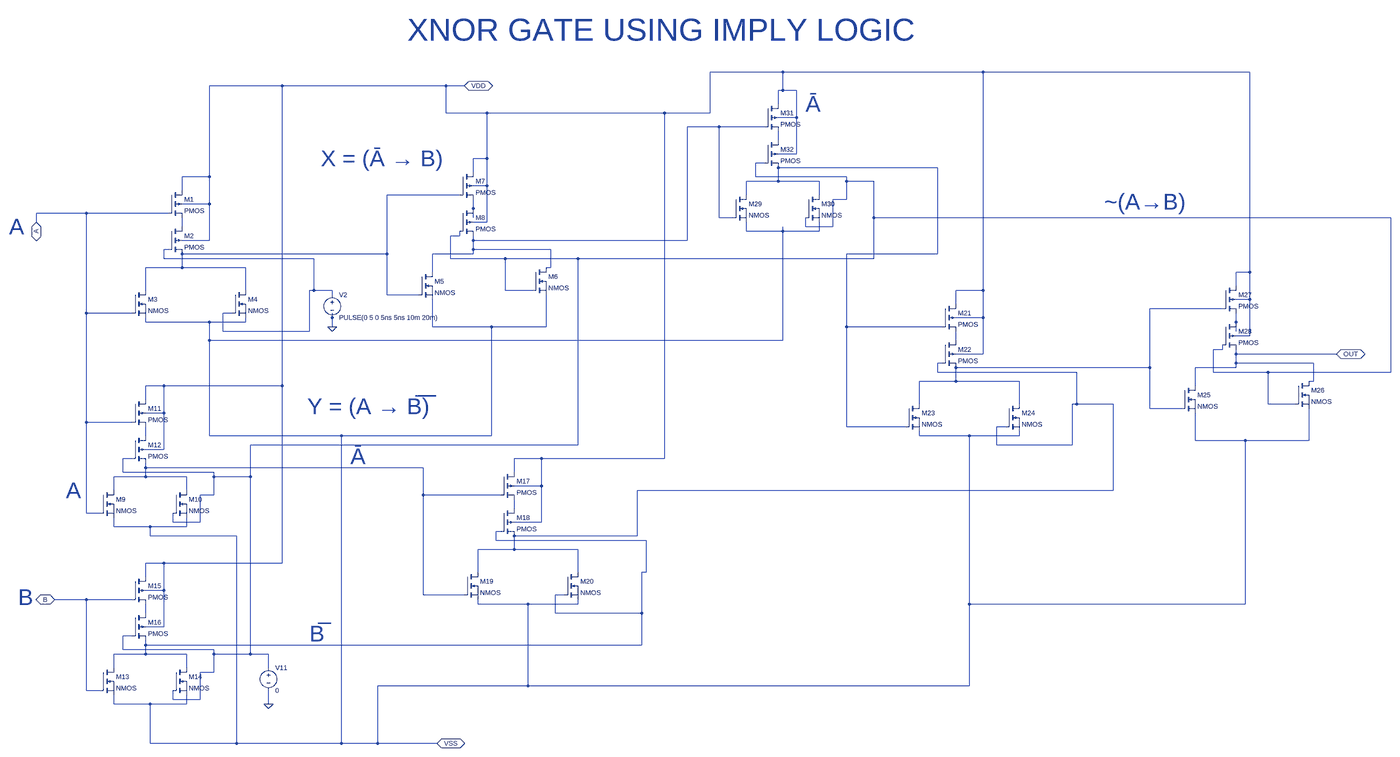
[diagram p0: schematic xnorimply.asc, whole sheet]
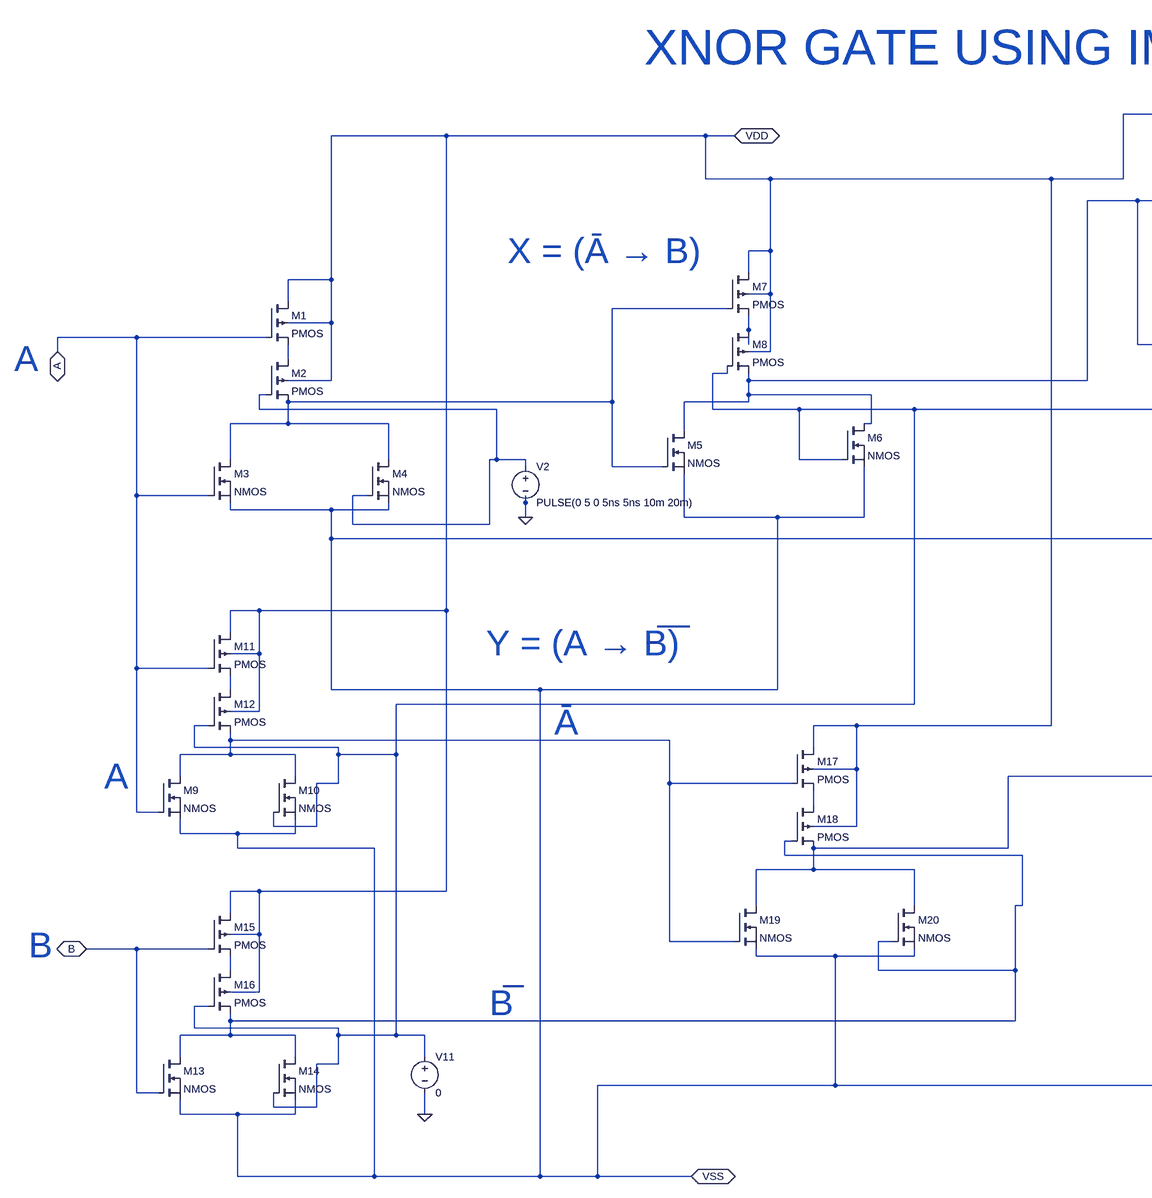
[diagram p1: schematic xnorimply.asc, part, row 1 of 1, column 1 of 2]
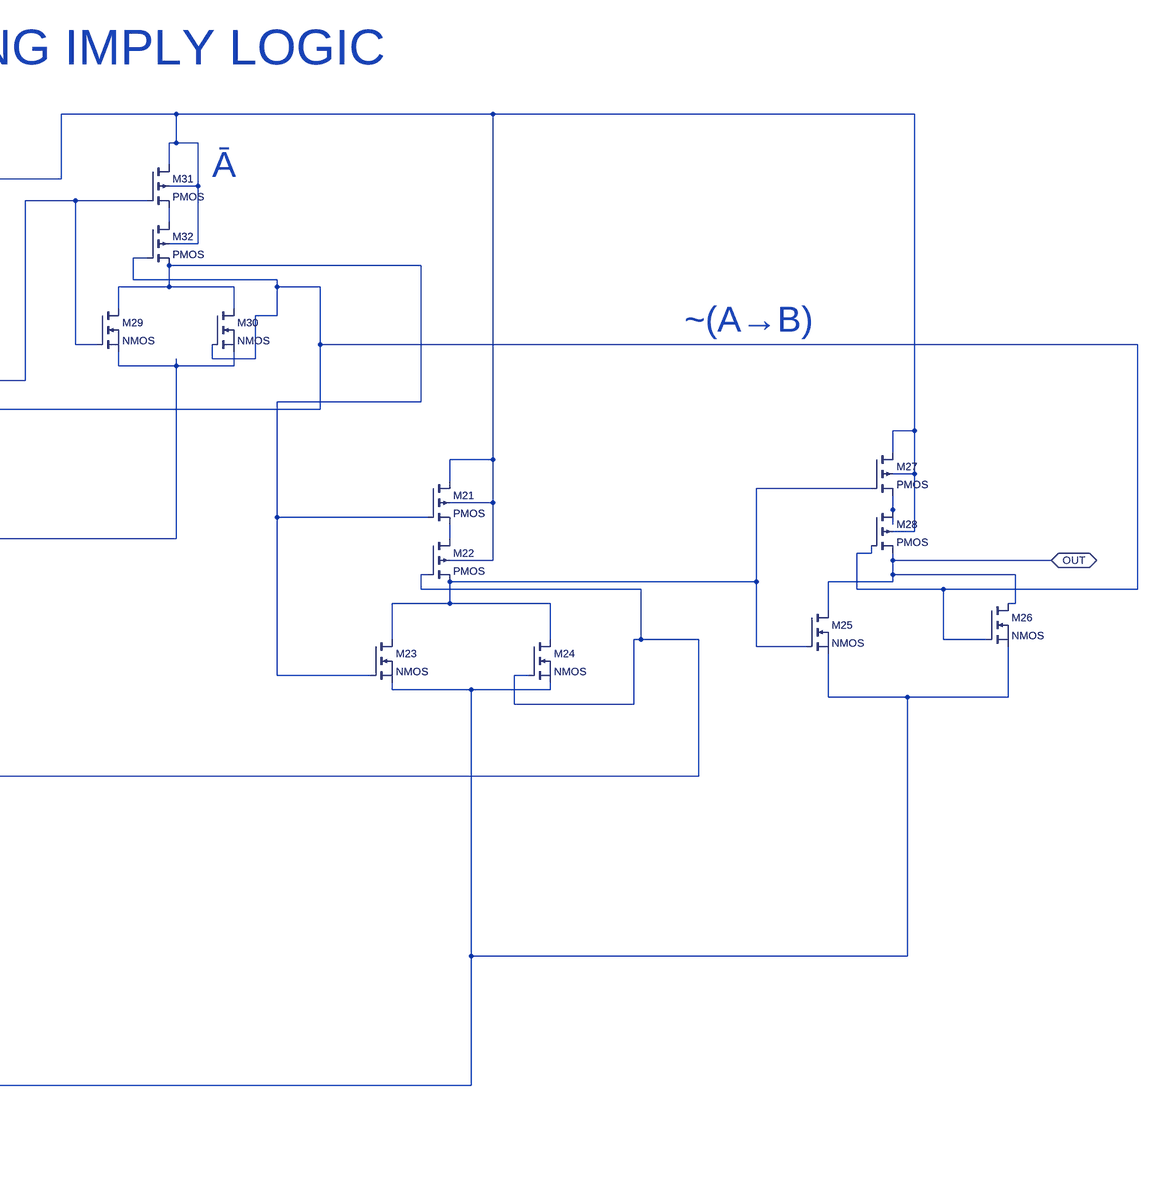
[diagram p2: schematic xnorimply.asc, part, row 1 of 1, column 2 of 2]
xnorimply.asc, the LTspice schematic file:
Version 4
SHEET 1 2996 1624
WIRE 816 -832 560 -832
WIRE 1520 -832 816 -832
WIRE 2496 -832 1520 -832
WIRE -944 -784 -1200 -784
WIRE -368 -784 -944 -784
WIRE -304 -784 -368 -784
WIRE 816 -768 816 -832
WIRE 816 -768 800 -768
WIRE 864 -768 816 -768
WIRE 800 -720 800 -768
WIRE -368 -688 -368 -784
WIRE -224 -688 -368 -688
WIRE 400 -688 -224 -688
WIRE 560 -688 560 -832
WIRE 560 -688 400 -688
WIRE 864 -672 864 -768
WIRE 864 -672 800 -672
WIRE 592 -640 480 -640
WIRE 752 -640 592 -640
WIRE 800 -592 800 -624
WIRE 864 -544 864 -672
WIRE 864 -544 800 -544
WIRE -224 -528 -224 -688
WIRE -224 -528 -272 -528
WIRE 752 -512 720 -512
WIRE 1360 -496 800 -496
WIRE -272 -480 -272 -528
WIRE -1200 -464 -1200 -784
WIRE -1200 -464 -1296 -464
WIRE 720 -464 720 -512
WIRE 1040 -464 720 -464
WIRE 800 -448 800 -496
WIRE 800 -448 688 -448
WIRE 944 -448 800 -448
WIRE 1040 -448 1040 -464
WIRE 1136 -448 1040 -448
WIRE -224 -432 -224 -528
WIRE -224 -432 -272 -432
WIRE -1296 -416 -1296 -464
WIRE -320 -400 -576 -400
WIRE 688 -400 688 -448
WIRE 944 -400 944 -448
WIRE 1040 -384 1040 -448
WIRE 1040 -384 992 -384
WIRE -1200 -368 -1200 -464
WIRE -1200 -368 -1296 -368
WIRE -272 -352 -272 -384
WIRE -1632 -336 -1808 -336
WIRE -1344 -336 -1632 -336
WIRE -272 -320 -272 -352
WIRE 592 -320 592 -640
WIRE 640 -320 592 -320
WIRE 1136 -320 1136 -448
WIRE 2992 -320 1136 -320
WIRE -1808 -304 -1808 -336
WIRE -224 -304 -224 -432
WIRE -224 -304 -272 -304
WIRE -1296 -288 -1296 -320
WIRE 896 -288 896 -320
WIRE 992 -288 992 -384
WIRE 992 -288 896 -288
WIRE 688 -272 688 -304
WIRE 816 -272 816 -288
WIRE 816 -272 688 -272
WIRE 944 -272 944 -304
WIRE 944 -272 816 -272
WIRE -320 -256 -320 -272
WIRE -320 -256 -352 -256
WIRE -1200 -240 -1200 -368
WIRE -1200 -240 -1296 -240
WIRE -272 -240 -272 -256
WIRE 480 -240 480 -640
WIRE 480 -240 -272 -240
WIRE -1344 -208 -1360 -208
WIRE -272 -208 -272 -240
WIRE 0 -208 -272 -208
WIRE -576 -192 -576 -400
WIRE -576 -192 -1296 -192
WIRE -272 -192 -272 -208
WIRE -272 -192 -416 -192
WIRE 1360 -192 1360 -496
WIRE 1360 -192 1040 -192
WIRE -1360 -176 -1360 -208
WIRE -832 -176 -1360 -176
WIRE -352 -176 -352 -256
WIRE -160 -176 -352 -176
WIRE 96 -176 -160 -176
WIRE 1136 -176 1136 -320
WIRE 1136 -176 96 -176
WIRE -1296 -144 -1296 -192
WIRE -1296 -144 -1424 -144
WIRE -1072 -144 -1296 -144
WIRE 0 -144 0 -208
WIRE 0 -144 -16 -144
WIRE -416 -128 -416 -192
WIRE 2496 -128 2496 -832
WIRE 2496 -128 2448 -128
WIRE 2448 -80 2448 -128
WIRE -1424 -64 -1424 -144
WIRE -1072 -64 -1072 -144
WIRE -832 -64 -832 -176
WIRE -832 -64 -848 -64
WIRE -768 -64 -832 -64
WIRE -160 -64 -160 -176
WIRE -64 -64 -160 -64
WIRE 1520 -64 1520 -832
WIRE 1520 -64 1424 -64
WIRE -768 -48 -768 -64
WIRE -576 -48 -576 -192
WIRE -464 -48 -576 -48
WIRE 2496 -32 2496 -128
WIRE 2496 -32 2448 -32
WIRE 1424 -16 1424 -64
WIRE 2400 0 2144 0
WIRE -1632 16 -1632 -336
WIRE -1472 16 -1632 16
WIRE -1120 16 -1152 16
WIRE -768 32 -768 16
WIRE 1520 32 1520 -64
WIRE 1520 32 1424 32
WIRE -1424 48 -1424 32
WIRE -1200 48 -1424 48
WIRE -1072 48 -1072 32
WIRE -1072 48 -1200 48
WIRE 2448 48 2448 16
WIRE -768 64 -768 32
WIRE -416 64 -416 -32
WIRE -208 64 -416 64
WIRE -16 64 -16 -48
WIRE -16 64 -208 64
WIRE 1040 64 1040 -192
WIRE 1376 64 1040 64
WIRE -1152 80 -1152 16
WIRE -848 80 -848 -64
WIRE -848 80 -1152 80
WIRE 2448 80 2448 48
WIRE 2496 96 2496 -32
WIRE 2496 96 2448 96
WIRE -1200 112 -1200 48
WIRE 816 112 816 -272
WIRE 816 112 -1200 112
WIRE 1424 112 1424 80
WIRE 2400 144 2400 128
WIRE 2400 144 2368 144
WIRE 1520 160 1520 32
WIRE 1520 160 1424 160
WIRE 2448 160 2448 144
WIRE 2800 160 2448 160
WIRE 1376 192 1360 192
WIRE 2448 192 2448 160
WIRE 2720 192 2448 192
WIRE 2144 208 2144 0
WIRE 2144 208 1424 208
WIRE 2448 208 2448 192
WIRE 2448 208 2304 208
WIRE 1360 224 1360 192
WIRE 1888 224 1360 224
WIRE 2368 224 2368 144
WIRE 2560 224 2368 224
WIRE 2992 224 2992 -320
WIRE 2992 224 2560 224
WIRE 1424 256 1424 208
WIRE 1424 256 1296 256
WIRE 1648 256 1424 256
WIRE 2720 256 2720 192
WIRE 2720 256 2704 256
WIRE -1360 272 -1424 272
WIRE -944 272 -944 -784
WIRE -944 272 -1360 272
WIRE 2304 272 2304 208
WIRE -1424 320 -1424 272
WIRE 1296 336 1296 256
WIRE 1648 336 1648 256
WIRE 1888 336 1888 224
WIRE 1888 336 1872 336
WIRE 2016 336 1888 336
WIRE 2560 336 2560 224
WIRE 2656 336 2560 336
WIRE 2144 352 2144 208
WIRE 2256 352 2144 352
WIRE -1360 368 -1360 272
WIRE -1360 368 -1424 368
WIRE -1632 400 -1632 16
WIRE -1472 400 -1632 400
WIRE 1040 416 1040 64
WIRE 1248 416 1040 416
WIRE 1600 416 1568 416
WIRE -1424 448 -1424 416
WIRE -1200 448 -1200 112
WIRE -736 448 -1200 448
WIRE -208 448 -208 64
WIRE -208 448 -736 448
WIRE 1296 448 1296 432
WIRE 1472 448 1296 448
WIRE 1648 448 1648 432
WIRE 1648 448 1472 448
WIRE 2304 464 2304 368
WIRE 2480 464 2304 464
WIRE 2704 464 2704 352
WIRE 2704 464 2480 464
WIRE 96 480 96 -176
WIRE 96 480 -1056 480
WIRE 1568 480 1568 416
WIRE 1872 480 1872 336
WIRE 1872 480 1568 480
WIRE -1360 496 -1360 368
WIRE -1360 496 -1424 496
WIRE -1472 528 -1504 528
WIRE -32 528 -128 528
WIRE 400 528 400 -688
WIRE 400 528 -32 528
WIRE -1424 560 -1424 544
WIRE -448 560 -1424 560
WIRE -1504 576 -1504 528
WIRE -1184 576 -1504 576
WIRE -128 576 -128 528
WIRE -1424 592 -1424 560
WIRE -1424 592 -1536 592
WIRE -1280 592 -1424 592
WIRE -1184 592 -1184 576
WIRE -1056 592 -1056 480
WIRE -1056 592 -1184 592
WIRE -32 624 -32 528
WIRE -32 624 -128 624
WIRE -1536 640 -1536 592
WIRE -1280 640 -1280 592
WIRE 2016 640 2016 336
WIRE 2016 640 304 640
WIRE -1184 656 -1184 592
WIRE -1184 656 -1232 656
WIRE -448 656 -448 560
WIRE -176 656 -448 656
WIRE -128 704 -128 672
WIRE -1632 720 -1632 400
WIRE -1584 720 -1632 720
WIRE -1328 752 -1328 720
WIRE -1232 752 -1232 656
WIRE -1232 752 -1328 752
WIRE -32 752 -32 624
WIRE -32 752 -128 752
WIRE -1536 768 -1536 736
WIRE -1408 768 -1536 768
WIRE -1280 768 -1280 736
WIRE -1280 768 -1408 768
WIRE -176 784 -192 784
WIRE -1408 800 -1408 768
WIRE -1104 800 -1408 800
WIRE 304 800 304 640
WIRE 304 800 -128 800
WIRE -192 816 -192 784
WIRE 336 816 -192 816
WIRE -128 848 -128 800
WIRE -128 848 -256 848
WIRE 96 848 -128 848
WIRE -1360 896 -1424 896
WIRE -944 896 -944 272
WIRE -944 896 -1360 896
WIRE -256 928 -256 848
WIRE 96 928 96 848
WIRE 336 928 336 816
WIRE 336 928 320 928
WIRE -1424 944 -1424 896
WIRE -1360 992 -1360 896
WIRE -1360 992 -1424 992
WIRE -448 1008 -448 656
WIRE -304 1008 -448 1008
WIRE 48 1008 16 1008
WIRE -1632 1024 -1744 1024
WIRE -1472 1024 -1632 1024
WIRE -256 1040 -256 1024
WIRE -80 1040 -256 1040
WIRE 96 1040 96 1024
WIRE 96 1040 -80 1040
WIRE 1472 1040 1472 448
WIRE 2480 1040 2480 464
WIRE 2480 1040 1472 1040
WIRE -1424 1072 -1424 1040
WIRE 16 1072 16 1008
WIRE 320 1072 320 928
WIRE 320 1072 16 1072
WIRE -1360 1120 -1360 992
WIRE -1360 1120 -1424 1120
WIRE -1472 1152 -1504 1152
WIRE -1424 1184 -1424 1168
WIRE 320 1184 320 1072
WIRE 320 1184 -1424 1184
WIRE -1504 1200 -1504 1152
WIRE -1184 1200 -1504 1200
WIRE -1424 1216 -1424 1184
WIRE -1424 1216 -1536 1216
WIRE -1280 1216 -1424 1216
WIRE -1184 1216 -1184 1200
WIRE -1056 1216 -1056 592
WIRE -1056 1216 -1184 1216
WIRE -992 1216 -1056 1216
WIRE -1536 1264 -1536 1216
WIRE -1280 1264 -1280 1216
WIRE -992 1264 -992 1216
WIRE -1184 1280 -1184 1216
WIRE -1184 1280 -1232 1280
WIRE -80 1328 -80 1040
WIRE -80 1328 -608 1328
WIRE 1472 1328 1472 1040
WIRE 1472 1328 -80 1328
WIRE -1632 1344 -1632 1024
WIRE -1584 1344 -1632 1344
WIRE -1328 1376 -1328 1344
WIRE -1232 1376 -1232 1280
WIRE -1232 1376 -1328 1376
WIRE -1536 1392 -1536 1360
WIRE -1408 1392 -1536 1392
WIRE -1280 1392 -1280 1360
WIRE -1280 1392 -1408 1392
WIRE -992 1392 -992 1344
WIRE -1408 1552 -1408 1392
WIRE -1104 1552 -1104 800
WIRE -1104 1552 -1408 1552
WIRE -736 1552 -736 448
WIRE -736 1552 -1104 1552
WIRE -608 1552 -608 1328
WIRE -608 1552 -736 1552
WIRE -400 1552 -608 1552
FLAG -768 64 0
FLAG -992 1392 0
FLAG 2800 160 OUT
IOPIN 2800 160 BiDir
FLAG -1808 -304 A
IOPIN -1808 -304 BiDir
FLAG -1744 1024 B
IOPIN -1744 1024 BiDir
FLAG -400 1552 VSS
IOPIN -400 1552 BiDir
FLAG -304 -784 VDD
IOPIN -304 -784 BiDir
SYMBOL pmos4 -1344 -416 R0
SYMATTR InstName M1
SYMBOL pmos4 -1344 -288 R0
SYMATTR InstName M2
SYMBOL nmos -1472 -64 R0
SYMATTR InstName M3
SYMBOL nmos -1120 -64 R0
SYMATTR InstName M4
SYMBOL voltage -768 -64 R0
WINDOW 123 0 0 Left 0
WINDOW 39 0 0 Left 0
SYMATTR InstName V2
SYMATTR Value PULSE(0 5 0 5ns 5ns 10m 20m)
SYMBOL nmos -464 -128 R0
SYMATTR InstName M5
SYMBOL nmos -64 -144 R0
SYMATTR InstName M6
SYMBOL pmos4 -320 -480 R0
SYMATTR InstName M7
SYMBOL pmos4 -320 -352 R0
SYMATTR InstName M8
SYMBOL nmos -1584 640 R0
SYMATTR InstName M9
SYMBOL nmos -1328 640 R0
SYMATTR InstName M10
SYMBOL pmos4 -1472 320 R0
SYMATTR InstName M11
SYMBOL pmos4 -1472 448 R0
SYMATTR InstName M12
SYMBOL nmos -1584 1264 R0
SYMATTR InstName M13
SYMBOL voltage -992 1248 R0
WINDOW 123 0 0 Left 0
WINDOW 39 0 0 Left 0
SYMATTR InstName V11
SYMATTR Value 0
SYMBOL nmos -1328 1264 R0
SYMATTR InstName M14
SYMBOL pmos4 -1472 944 R0
SYMATTR InstName M15
SYMBOL pmos4 -1472 1072 R0
SYMATTR InstName M16
SYMBOL pmos4 -176 576 R0
SYMATTR InstName M17
SYMBOL pmos4 -176 704 R0
SYMATTR InstName M18
SYMBOL nmos -304 928 R0
SYMATTR InstName M19
SYMBOL nmos 48 928 R0
SYMATTR InstName M20
SYMBOL pmos4 1376 -16 R0
SYMATTR InstName M21
SYMBOL pmos4 1376 112 R0
SYMATTR InstName M22
SYMBOL nmos 1248 336 R0
SYMATTR InstName M23
SYMBOL nmos 1600 336 R0
SYMATTR InstName M24
SYMBOL nmos 2256 272 R0
SYMATTR InstName M25
SYMBOL nmos 2656 256 R0
SYMATTR InstName M26
SYMBOL pmos4 2400 -80 R0
SYMATTR InstName M27
SYMBOL pmos4 2400 48 R0
SYMATTR InstName M28
SYMBOL nmos 640 -400 R0
SYMATTR InstName M29
SYMBOL nmos 896 -400 R0
SYMATTR InstName M30
SYMBOL pmos4 752 -720 R0
SYMATTR InstName M31
SYMBOL pmos4 752 -592 R0
SYMATTR InstName M32
TEXT -808 -528 Left 6 ;X = (Ā → B)
TEXT 1984 -376 Left 6 ;~(A→B)\n​
TEXT 896 -720 Left 6 ;Ā
TEXT -1904 -288 Left 6 ;A
TEXT -1872 1016 Left 6 ;B
TEXT -1704 640 Left 6 ;A
TEXT -848 1144 Left 6 ;B̅
TEXT -704 520 Left 6 ;Ā
TEXT -856 344 Left 6 ;Y = (A → B̅)̅
TEXT -504 -1008 Left 7 ;XNOR GATE USING IMPLY LOGIC

The netlist it stands for:
* xnorimply.asc
M1 VDD A N007 VDD PMOS
M2 N007 N008 N005 VDD PMOS
M3 N005 A VSS VSS NMOS
M4 N005 N008 VSS VSS NMOS
V2 N008 0 PULSE(0 5 0 5ns 5ns 10m 20m)
M5 N001 N005 VSS VSS NMOS
M6 N001 N003 VSS VSS NMOS
M7 VDD N005 N006 VDD PMOS
M8 N006 N003 N001 VDD PMOS
M9 N014 A VSS VSS NMOS
M10 N014 N003 VSS VSS NMOS
M11 VDD A N013 VDD PMOS
M12 N013 N003 N014 VDD PMOS
M13 N016 B VSS VSS NMOS
V11 N003 0 0
M14 N016 N003 VSS VSS NMOS
M15 VDD B N017 VDD PMOS
M16 N017 N003 N016 VDD PMOS
M17 VDD N014 N015 VDD PMOS
M18 N015 N016 N012 VDD PMOS
M19 N012 N014 VSS VSS NMOS
M20 N012 N016 VSS VSS NMOS
M21 VDD N004 N011 VDD PMOS
M22 N011 N012 N009 VDD PMOS
M23 N009 N004 VSS VSS NMOS
M24 N009 N012 VSS VSS NMOS
M25 OUT N009 VSS VSS NMOS
M26 OUT N003 VSS VSS NMOS
M27 VDD N009 N010 VDD PMOS
M28 N010 N003 OUT VDD PMOS
M29 N004 N001 VSS VSS NMOS
M30 N004 N003 VSS VSS NMOS
M31 VDD N001 N002 VDD PMOS
M32 N002 N003 N004 VDD PMOS
.model NMOS NMOS
.model PMOS PMOS
.lib standard.mos
* X = (Ā → B)
* ~(A→B)
* ​
* Ā
* A
* B
* A
* B̅
* Ā
* Y = (A → B̅)̅
* XNOR GATE USING IMPLY LOGIC
.backanno
.end